# Altium project MicMixer.PrjPcb
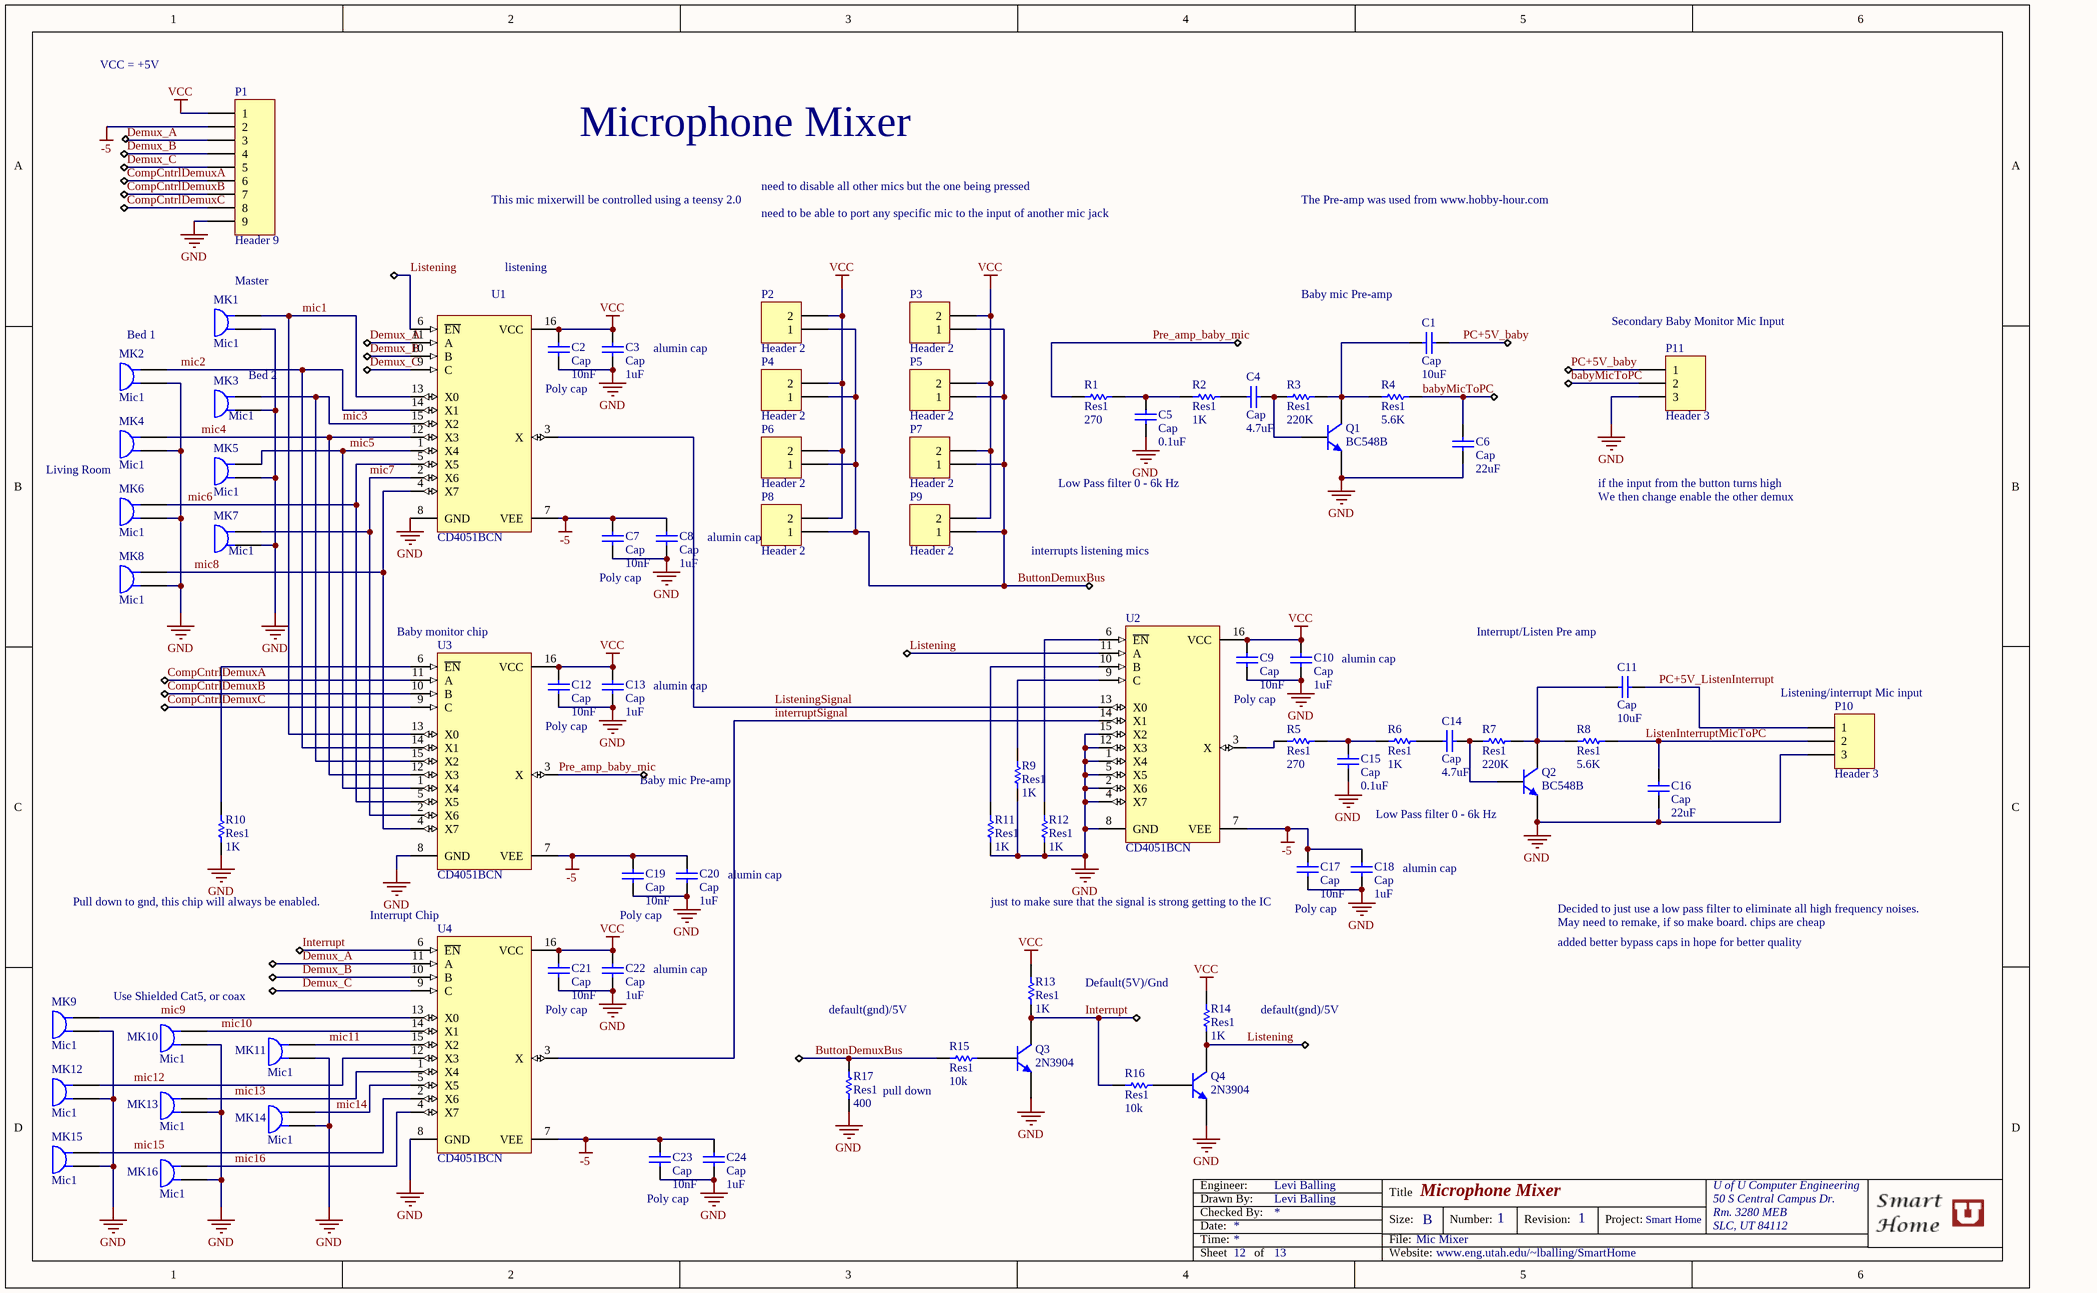
[diagram p0: MicMixer.SchDoc]
1 sheet, 76 parts. Net scope: global (net labels, ports and power ports of the same name join across sheets).

## Sheet MicMixer.SchDoc: Microphone Mixer
size B; CompanyName: Smart Home; DrawnBy: Levi Balling; Engineer: Levi Balling; Organization: U of U Computer Engineering; Address1: 50 S Central Campus Dr.; Address2: Rm. 3280 MEB; Address3: SLC, UT 84112; DocumentNumber: 1; Revision: 1; SheetNumber: 12; SheetTotal: 13; Website: www.eng.utah.edu/~lballing/SmartHome; Project: Smart Home; DocumentName: Mic Mixer; ProjectName: Smart Home

### Parts
C1  Cap  value 10uF  [RAD-0.2]
C2  Cap  value 10nF  [RAD-0.2]
C3  Cap  value 1uF  [RAD-0.2]
C4  Cap  value 4.7uF  [RAD-0.2]
C5  Cap  value 0.1uF  [RAD-0.2]
C6  Cap  value 22uF  [RAD-0.2]
C7  Cap  value 10nF  [RAD-0.2]
C8  Cap  value 1uF  [RAD-0.2]
C9  Cap  value 10nF  [RAD-0.2]
C10  Cap  value 1uF  [RAD-0.2]
C11  Cap  value 10uF  [RAD-0.2]
C12  Cap  value 10nF  [RAD-0.2]
C13  Cap  value 1uF  [RAD-0.2]
C14  Cap  value 4.7uF  [RAD-0.2]
C15  Cap  value 0.1uF  [RAD-0.2]
C16  Cap  value 22uF  [RAD-0.2]
C17  Cap  value 10nF  [RAD-0.2]
C18  Cap  value 1uF  [RAD-0.2]
C19  Cap  value 10nF  [RAD-0.2]
C20  Cap  value 1uF  [RAD-0.2]
C21  Cap  value 10nF  [RAD-0.2]
C22  Cap  value 1uF  [RAD-0.2]
C23  Cap  value 10nF  [RAD-0.2]
C24  Cap  value 1uF  [RAD-0.2]
MK1  Mic1  [PIN2]
MK2  Mic1  [PIN2]
MK3  Mic1  [PIN2]
MK4  Mic1  [PIN2]
MK5  Mic1  [PIN2]
MK6  Mic1  [PIN2]
MK7  Mic1  [PIN2]
MK8  Mic1  [PIN2]
MK9  Mic1  [PIN2]
MK10  Mic1  [PIN2]
MK11  Mic1  [PIN2]
MK12  Mic1  [PIN2]
MK13  Mic1  [PIN2]
MK14  Mic1  [PIN2]
MK15  Mic1  [PIN2]
MK16  Mic1  [PIN2]
P1  Header 9  [HDR1X9]
P2  Header 2  [HDR1X2]
P3  Header 2  [HDR1X2]
P4  Header 2  [HDR1X2]
P5  Header 2  [HDR1X2]
P6  Header 2  [HDR1X2]
P7  Header 2  [HDR1X2]
P8  Header 2  [HDR1X2]
P9  Header 2  [HDR1X2]
P10  Header 3  [HDR1X3]
P11  Header 3  [HDR1X3]
Q1  BC548B  [2N3904]
Q2  BC548B  [2N3904]
Q3  2N3904  [2N3904]
Q4  2N3904  [2N3904]
R1  Res1  value 270  [AXIAL-0.3]
R2  Res1  value 1K  [AXIAL-0.3]
R3  Res1  value 220K  [AXIAL-0.3]
R4  Res1  value 5.6K  [AXIAL-0.3]
R5  Res1  value 270  [AXIAL-0.3]
R6  Res1  value 1K  [AXIAL-0.3]
R7  Res1  value 220K  [AXIAL-0.3]
R8  Res1  value 5.6K  [AXIAL-0.3]
R9  Res1  value 1K  [AXIAL-0.3]
R10  Res1  value 1K  [AXIAL-0.3]
R11  Res1  value 1K  [AXIAL-0.3]
R12  Res1  value 1K  [AXIAL-0.3]
R13  Res1  value 1K  [AXIAL-0.3]
R14  Res1  value 1K  [AXIAL-0.3]
R15  Res1  value 10k  [AXIAL-0.3]
R16  Res1  value 10k  [AXIAL-0.3]
R17  Res1  value 400  [AXIAL-0.3]
U1  CD4051BCN  [N16E]
U2  CD4051BCN  [N16E]
U3  CD4051BCN  [N16E]
U4  CD4051BCN  [N16E]

### Nets
-5: C7.2 C8.2 C17.2 C18.2 C19.2 C20.2 C23.2 C24.2 P1.2 U1.7(VEE) U2.7(VEE) U3.7(VEE) U4.7(VEE)
GND: C2.1 C3.1 C5.2 C6.2 C7.1 C8.1 C9.1 C10.1 C12.1 C13.1 C15.2 C16.2 C17.1 C18.1 C19.1 C20.1 C21.1 C22.1 C23.1 C24.1 MK1.1 MK2.1 MK3.1 MK4.1 MK5.1 MK6.1 MK7.1 MK8.1 MK9.1 MK10.1 MK11.1 MK12.1 MK13.1 MK14.1 MK15.1 MK16.1 P1.9 P10.3 P11.3 Q1.1(E) Q2.1(E) Q3.1(E) Q4.1(E) R9.1 R10.1 R11.1 R12.1 R17.1 U1.8(GND) U2.1(X4) U2.2(X6) U2.4(X7) U2.5(X5) U2.8(GND) U2.12(X3) U2.15(X2) U3.8(GND) U4.8(GND)
VCC: C2.2 C3.2 C9.2 C10.2 C12.2 C13.2 C21.2 C22.2 P1.1 P2.2 P3.2 P4.2 P5.2 P6.2 P7.2 P8.2 P9.2 R13.1 R14.1 U1.16(VCC) U2.16(VCC) U3.16(VCC) U4.16(VCC)
babyMicToPC: C6.1 P11.2 R4.2
ButtonDemuxBus: P2.1 P3.1 P4.1 P5.1 P6.1 P7.1 P8.1 P9.1 R15.2 R17.2
CompCntrlDemuxA: P1.6 U3.11(A)
CompCntrlDemuxB: P1.7 U3.10(B)
CompCntrlDemuxC: P1.8 U3.9(C)
Demux_A: P1.3 U1.11(A) U4.11(A)
Demux_B: P1.4 U1.10(B) U4.10(B)
Demux_C: P1.5 U1.9(C) U4.9(C)
Interrupt: Q3.3(C) R13.2 R16.2 U4.6(~{EN})
interruptSignal: U2.14(X1) U4.3(X)
Listening: Q4.3(C) R14.2 U1.6(~{EN}) U2.11(A)
ListeningSignal: U1.3(X) U2.13(X0)
ListenInterruptMicToPC: C16.1 P10.2 R8.2
mic1: MK1.2 U1.13(X0) U3.13(X0)
mic2: MK2.2 U1.14(X1) U3.14(X1)
mic3: MK3.2 U1.15(X2) U3.15(X2)
mic4: MK4.2 U1.12(X3) U3.12(X3)
mic5: MK5.2 U1.1(X4) U3.1(X4)
mic6: MK6.2 U1.5(X5) U3.5(X5)
mic7: MK7.2 U1.2(X6) U3.2(X6)
mic8: MK8.2 U1.4(X7) U3.4(X7)
mic9: MK9.2 U4.13(X0)
mic10: MK10.2 U4.14(X1)
mic11: MK11.2 U4.15(X2)
mic12: MK12.2 U4.12(X3)
mic13: MK13.2 U4.1(X4)
mic14: MK14.2 U4.5(X5)
mic15: MK15.2 U4.2(X6)
mic16: MK16.2 U4.4(X7)
PC+5V_baby: C1.2 P11.1
PC+5V_ListenInterrupt: C11.2 P10.1
Pre_amp_baby_mic: R1.1 U3.3(X)
NetC1_1: C1.1 Q1.3(C) R3.2 R4.1
NetC4_1: C4.1 Q1.2(B) R3.1
NetC4_2: C4.2 R2.2
NetC5_1: C5.1 R1.2 R2.1
NetC11_1: C11.1 Q2.3(C) R7.2 R8.1
NetC14_1: C14.1 Q2.2(B) R7.1
NetC14_2: C14.2 R6.2
NetC15_1: C15.1 R5.2 R6.1
NetQ3_2: Q3.2(B) R15.1
NetQ4_2: Q4.2(B) R16.1
NetR5_1: R5.1 U2.3(X)
NetR9_2: R9.2 U2.9(C)
NetR10_2: R10.2 U3.6(~{EN})
NetR11_2: R11.2 U2.10(B)
NetR12_2: R12.2 U2.6(~{EN})

### Notes on the sheet
- VCC = +5V
- This mic mixerwill be controlled using a teensy 2.0
- need to disable all other mics but the one being pressed
- need to be able to port any specific mic to the input of another mic jack
- The Pre-amp was used from www.hobby-hour.com
- (near MK1) Master
- listening
- (near C1) Baby mic Pre-amp
- (near MK2) Bed 1
- (near C3) alumin cap
- (near P11) Secondary Baby Monitor Mic Input
- (near MK3) Bed 2
- (near U1) Poly cap
- Living Room
- Low Pass filter 0 - 6k Hz
- if the input from the button turns high
- We then change enable the other demux
- alumin cap
- interrupts listening mics
- (near U3) Baby monitor chip
- Poly cap
- (near C11) Interrupt/Listen Pre amp
- (near C13) alumin cap
- (near U2) Poly cap
- (near C10) alumin cap
- (near P10) Listening/interrupt Mic input
- (near U3) Poly cap
- Baby mic Pre-amp
- (near Q2) Low Pass filter 0 - 6k Hz
- Pull down to gnd, this chip will always be enabled.
- (near C20) alumin cap
- just to make sure that the signal is strong getting to the IC
- (near C18) alumin cap
- Decided to just use a low pass filter to eliminate all high frequency noises.
- (near U4) Interrupt Chip
- (near C22) alumin cap
- May need to remake, if so make board. chips are cheap
- added better bypass caps in hope for better quality
- Use Shielded Cat5, or coax
- (near U4) Poly cap
- default(gnd)/5V
- (near R14) Default(5V)/Gnd
- pull down
- Date:
- Time:
- Engineer:
- Drawn By:
- Checked By:
- Title
- Size:
- File:
- B
- Number:
- Revision:
- Project:
- Sheet
- of
- Website:

### Library data of the parts
C1-C24 = Cap: Capacitor; Vendor: Taydaelectronics; Published: 8-Jun-2000; LatestRevisionDate: 17-Jul-2002; LatestRevisionNote: Re-released for DXP Platform.; PackageReference: RAD-0.3; Publisher: Altium Limited; PackageDescription: Radial Cap, Thru-Hole; 2 Leads; 0.3 in Pin Spacing
  C1 C3-C6 C8 C10 C11 C13-C16 C18 C20 C22 C24: Price: 0.03
  C2 C7 C9 C12 C17 C19 C21 C23: Price: 0.04
MK1-MK16 = Mic1: Microphone; Vendor: Taydaelectronics; Published: 24-Mar-1999; LatestRevisionDate: 17-Jul-2002; LatestRevisionNote: Re-released for DXP Platform.; PackageReference: PIN2; Publisher: Altium Limited; Price: 0.25; Value: Mic1
P1 = Header 9: Header, 9-Pin; Vendor: Taydaelectronics; LatestRevisionDate: 17-Jul-2002; LatestRevisionNote: Re-released for DXP Platform.; Publisher: Altium Limited; Price: 0.09; Value: Header 9
P2-P9 = Header 2: Header, 2-Pin; Vendor: Taydaelectronics; LatestRevisionDate: 17-Jul-2002; LatestRevisionNote: Re-released for DXP Platform.; Publisher: Altium Limited; Price: 0.02; Value: Header 2
P10 P11 = Header 3: Header, 3-Pin; Vendor: Taydaelectronics; LatestRevisionDate: 17-Jul-2002; LatestRevisionNote: Re-released for DXP Platform.; Publisher: Altium Limited; Price: 0.03; Value: Header 3
Q1-Q4 = 2N3904: NPN General Purpose Amplifier; Vendor: Taydaelectronics; Published: 8-Jun-2000; LatestRevisionDate: 15-Jan-2003; LatestRevisionNote: PCB Footprint 'BCY-W3/D4.7' replaced; DatasheetVersion: 1997; PackageVersion: Sep-1998; PackageReference: TO-92A; Publisher: Altium Limited; PackageDescription: TO, Flat Index; 3 In-Line, Axial Leads; Body Dia. 4.5mm; Leads 0.51 x 0.48 mm (max); ComponentLink1URL: http://www.fairchildsemi.com/; ComponentLink2Description: Datasheet; ComponentLink2URL: http://www.fairchildsemi.com/ds/2N%2F2N3904.pdf; Price: 0.01
  Q1 Q2: Value: BC548B
  Q3 Q4: Value: 2N3904
R1-R17 = Res1: Resistor; Vendor: Taydaelectronics; Published: 8-Jun-2000; LatestRevisionDate: 17-Jul-2002; LatestRevisionNote: Re-released for DXP Platform.; PackageReference: AXIAL-0.3; Publisher: Altium Limited; PackageDescription: Axial Device, Thru-Hole; 2 Leads; 0.3 in Pin Spacing; Price: 0.01
U1-U4 = CD4051BCN: 8-Channel Analog Multiplexer/Demultiplexer; Vendor: Taydaelectronics; Published: 17-Jul-2002; LatestRevisionDate: 29-May-2009; LatestRevisionNote: Component Body Added.; DatasheetVersion: Jan-1999; PackageVersion: 2000; PackageReference: N16E; Publisher: Altium Limited; PackageDescription: DIP, 16-Pin, Row Spacing 7.62 mm, Pitch 2.54 mm; ComponentLink1URL: http://www.fairchildsemi.com/; ComponentLink2Description: Datasheet; ComponentLink2URL: http://www.fairchildsemi.com/ds/CD%2FCD4052BC.pdf; Price: 0.23; Value: CD4051BCN